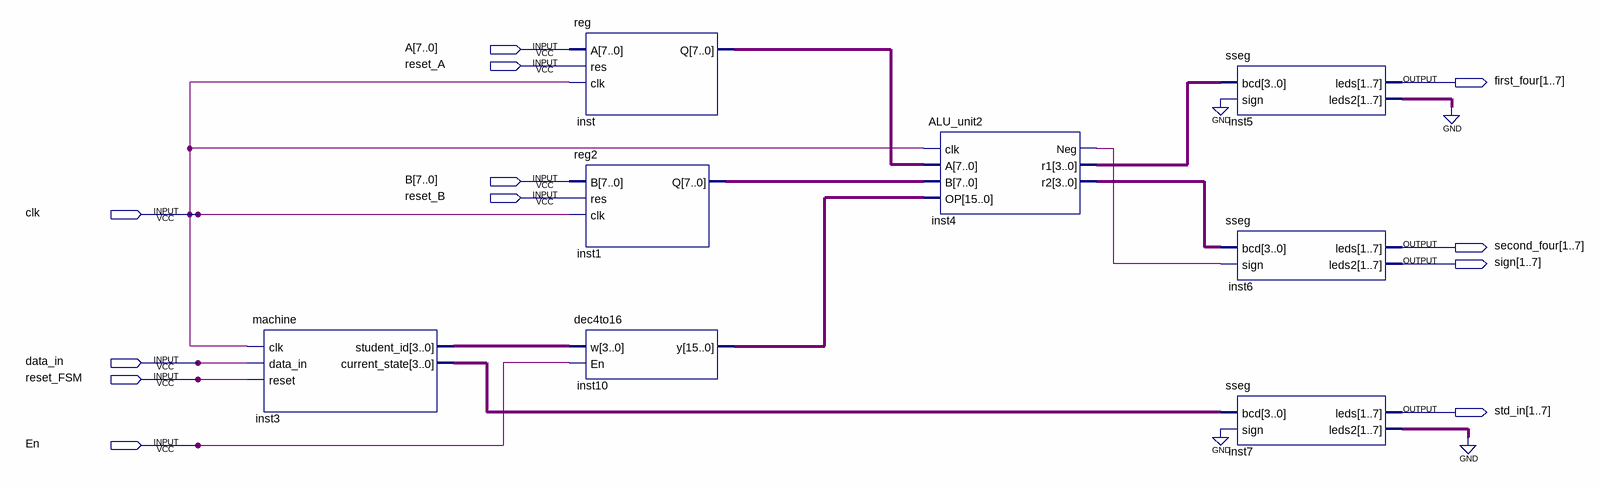
[diagram p0: schematic sheet]
// Quartus schematic Problem2BDF.bdf as structural Verilog: 8 symbols, 12 pins
module Problem2BDF (
  input  [7:0] A,
  input  reset_A,
  input  [7:0] B,
  input  reset_B,
  input  clk,
  input  data_in,
  input  reset_FSM,
  input  En,
  output [1:7] first_four,
  output [1:7] second_four,
  output [1:7] sign,
  output [1:7] std_in
);

  wire inst4_neg;
  wire [3:0] inst3_current_state, inst3_student_id, inst4_r1, inst4_r2;
  wire [6:0] inst5_leds2, inst7_leds2;
  wire [7:0] inst1_q, inst_q;
  wire [15:0] inst10_y;

  machine inst3 (
    .clk(clk), .data_in(data_in), .reset(reset_FSM), .student_id(inst3_student_id),
    .current_state(inst3_current_state));
  \reg  inst (.clk(clk), .Q(inst_q));  // open: A, res
  reg2 inst1 (.clk(clk), .Q(inst1_q));  // open: B, res
  dec4to16 inst10 (.w(inst3_student_id), .En(En), .y(inst10_y));
  ALU_unit2 inst4 (.clk(clk), .A(inst_q), .B(inst1_q), .OP(inst10_y), .Neg(inst4_neg), .r1(inst4_r1), .r2(inst4_r2));
  sseg inst5 (.bcd(inst4_r1), .sign(1'b0), .leds(first_four), .leds2(inst5_leds2));
  sseg inst6 (.bcd(inst4_r2), .sign(inst4_neg), .leds(second_four), .leds2(sign));
  sseg inst7 (.bcd(inst3_current_state), .sign(1'b0), .leds(std_in), .leds2(inst7_leds2));
  // also tied to GND on the sheet: {inst7_leds2[0], inst7_leds2[1], inst7_leds2[2], inst7_leds2[3], inst7_leds2[4], inst7_leds2[5], inst7_leds2[6], inst5_leds2[0], inst5_leds2[1], inst5_leds2[2], inst5_leds2[3], inst5_leds2[4], inst5_leds2[5], inst5_leds2[6]}
endmodule
